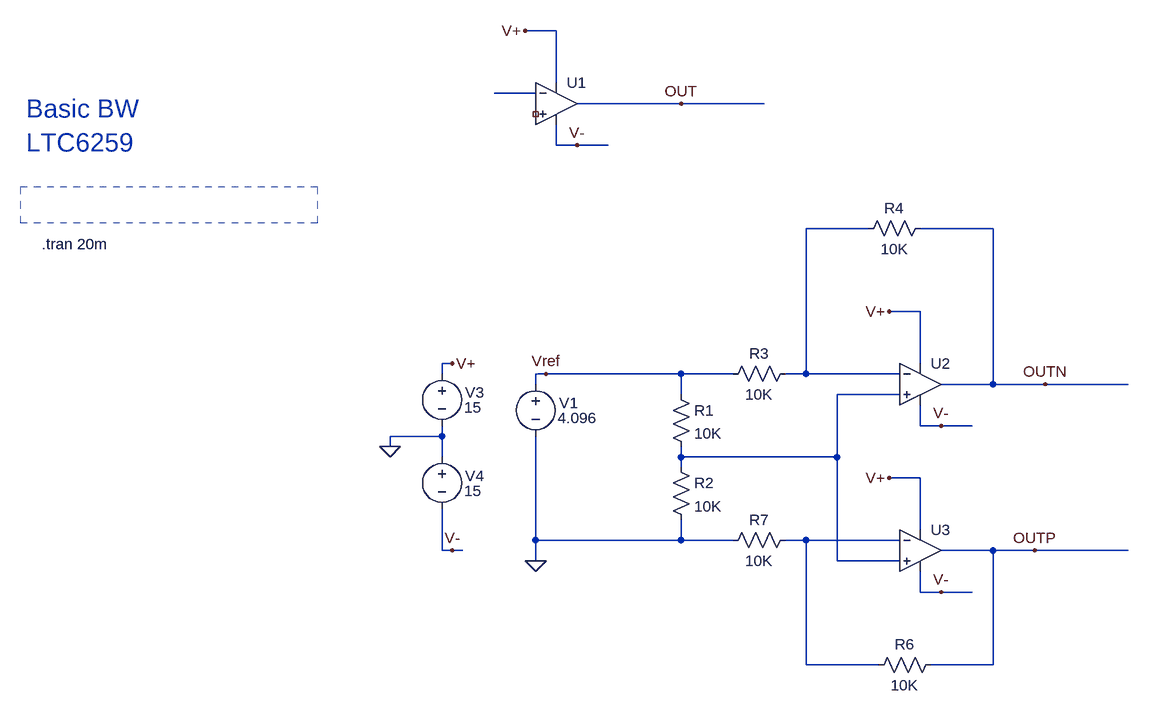
[diagram p0: schematic SEtoDiff.asc]
SEtoDiff.asc, the LTspice schematic file:
Version 4
SHEET 1 1928 1456
WIRE -4784 -3424 -4832 -3424
WIRE -4784 -3344 -4784 -3424
WIRE -4816 -3328 -4880 -3328
WIRE -4592 -3312 -4752 -3312
WIRE -4464 -3312 -4592 -3312
WIRE -4784 -3248 -4784 -3280
WIRE -4752 -3248 -4784 -3248
WIRE -4704 -3248 -4752 -3248
WIRE -4304 -3120 -4400 -3120
WIRE -4112 -3120 -4224 -3120
WIRE -4224 -2992 -4272 -2992
WIRE -4944 -2912 -4960 -2912
WIRE -4224 -2912 -4224 -2992
WIRE -4960 -2896 -4960 -2912
WIRE -4800 -2896 -4816 -2896
WIRE -4592 -2896 -4800 -2896
WIRE -4512 -2896 -4592 -2896
WIRE -4400 -2896 -4400 -3120
WIRE -4400 -2896 -4432 -2896
WIRE -4256 -2896 -4400 -2896
WIRE -4816 -2880 -4816 -2896
WIRE -4112 -2880 -4112 -3120
WIRE -4112 -2880 -4192 -2880
WIRE -4032 -2880 -4112 -2880
WIRE -3904 -2880 -4032 -2880
WIRE -4592 -2864 -4592 -2896
WIRE -4256 -2864 -4352 -2864
WIRE -4224 -2816 -4224 -2848
WIRE -4192 -2816 -4224 -2816
WIRE -4144 -2816 -4192 -2816
WIRE -4960 -2800 -4960 -2816
WIRE -4960 -2800 -5040 -2800
WIRE -5040 -2784 -5040 -2800
WIRE -4960 -2768 -4960 -2800
WIRE -4592 -2768 -4592 -2784
WIRE -4352 -2768 -4352 -2864
WIRE -4352 -2768 -4592 -2768
WIRE -4592 -2752 -4592 -2768
WIRE -4224 -2736 -4272 -2736
WIRE -4224 -2656 -4224 -2736
WIRE -4816 -2640 -4816 -2800
WIRE -4592 -2640 -4592 -2672
WIRE -4592 -2640 -4816 -2640
WIRE -4512 -2640 -4592 -2640
WIRE -4400 -2640 -4432 -2640
WIRE -4256 -2640 -4400 -2640
WIRE -4960 -2624 -4960 -2688
WIRE -4944 -2624 -4960 -2624
WIRE -4928 -2624 -4944 -2624
WIRE -4112 -2624 -4192 -2624
WIRE -4048 -2624 -4112 -2624
WIRE -3904 -2624 -4048 -2624
WIRE -4816 -2608 -4816 -2640
WIRE -4352 -2608 -4352 -2768
WIRE -4256 -2608 -4352 -2608
WIRE -4224 -2560 -4224 -2592
WIRE -4192 -2560 -4224 -2560
WIRE -4144 -2560 -4192 -2560
WIRE -4400 -2448 -4400 -2640
WIRE -4288 -2448 -4400 -2448
WIRE -4112 -2448 -4112 -2624
WIRE -4112 -2448 -4208 -2448
FLAG -4832 -3424 V+
FLAG -4944 -2912 V+
FLAG -5040 -2784 0
FLAG -4944 -2624 V-
FLAG -4752 -3248 V-
FLAG -4592 -3312 OUT
FLAG -4800 -2896 Vref
FLAG -4816 -2608 0
FLAG -4272 -2992 V+
FLAG -4192 -2816 V-
FLAG -4032 -2880 OUTN
FLAG -4272 -2736 V+
FLAG -4192 -2560 V-
FLAG -4048 -2624 OUTP
SYMBOL Opamps\\UniversalOpamp2 -4784 -3312 R0
SYMATTR Value2 Avol=1000000 GBW=1Meg Slew=0.22Meg
SYMATTR SpiceLine2 en=1.2n enk=10 in=3.75p ink=30 Rin=500Meg
SYMATTR InstName U1
SYMBOL voltage -4960 -2912 R0
WINDOW 0 36 45 Left 2
WINDOW 3 34 68 Left 2
WINDOW 123 0 0 Left 2
WINDOW 39 0 0 Left 2
SYMATTR InstName V3
SYMATTR Value 15
SYMBOL voltage -4960 -2784 R0
WINDOW 0 36 45 Left 2
WINDOW 3 34 68 Left 2
WINDOW 123 0 0 Left 2
WINDOW 39 0 0 Left 2
SYMATTR InstName V4
SYMATTR Value 15
SYMBOL voltage -4816 -2896 R0
WINDOW 0 36 45 Left 2
WINDOW 3 34 68 Left 2
WINDOW 123 0 0 Left 2
WINDOW 39 0 0 Left 2
SYMATTR InstName V1
SYMATTR Value 4.096
SYMBOL res -4608 -2880 R0
SYMATTR InstName R1
SYMATTR Value 10K
SYMBOL res -4608 -2768 R0
SYMATTR InstName R2
SYMATTR Value 10K
SYMBOL Opamps\\UniversalOpamp2 -4224 -2880 R0
SYMATTR Value2 Avol=1000000 GBW=1Meg Slew=0.22Meg
SYMATTR SpiceLine2 en=1.2n enk=10 in=3.75p ink=30 Rin=500Meg
SYMATTR InstName U2
SYMBOL res -4416 -2912 R90
WINDOW 0 0 56 VBottom 2
WINDOW 3 32 56 VTop 2
SYMATTR InstName R3
SYMATTR Value 10K
SYMBOL res -4208 -3136 R90
WINDOW 0 0 56 VBottom 2
WINDOW 3 32 56 VTop 2
SYMATTR InstName R4
SYMATTR Value 10K
SYMBOL Opamps\\UniversalOpamp2 -4224 -2624 R0
SYMATTR Value2 Avol=1000000 GBW=1Meg Slew=0.22Meg
SYMATTR SpiceLine2 en=1.2n enk=10 in=3.75p ink=30 Rin=500Meg
SYMATTR InstName U3
SYMBOL res -4192 -2464 R90
WINDOW 0 0 56 VBottom 2
WINDOW 3 32 56 VTop 2
SYMATTR InstName R6
SYMATTR Value 10K
SYMBOL res -4416 -2656 R90
WINDOW 0 0 56 VBottom 2
WINDOW 3 32 56 VTop 2
SYMATTR InstName R7
SYMATTR Value 10K
TEXT -5600 -3304 Left 4 ;Basic BW\nLTC6259
TEXT -5576 -3096 Left 2 !.tran 20m
RECTANGLE Normal -5152 -3128 -5608 -3184 2

The netlist it stands for:
* SEtoDiff.asc
XU1 NC_01 N001 V+ V- OUT level.2 Avol=1000000 GBW=1Meg Slew=0.22Meg ilimit=25m rail=0 Vos=0 phimargin=45 en=1.2n enk=10 in=3.75p ink=30 Rin=500Meg  ; pins IN+ IN- V+ V- OUT
V3 V+ 0 15
V4 0 V- 15
V1 Vref 0 4.096
R1 Vref N003 10K
R2 N003 0 10K
XU2 N003 N002 V+ V- OUTN level.2 Avol=1000000 GBW=1Meg Slew=0.22Meg ilimit=25m rail=0 Vos=0 phimargin=45 en=1.2n enk=10 in=3.75p ink=30 Rin=500Meg  ; pins IN+ IN- V+ V- OUT
R3 N002 Vref 10K
R4 OUTN N002 10K
XU3 N003 N004 V+ V- OUTP level.2 Avol=1000000 GBW=1Meg Slew=0.22Meg ilimit=25m rail=0 Vos=0 phimargin=45 en=1.2n enk=10 in=3.75p ink=30 Rin=500Meg  ; pins IN+ IN- V+ V- OUT
R6 OUTP N004 10K
R7 N004 0 10K
* Basic BW
* LTC6259
.tran 20m
.lib UniversalOpamps2.sub
.backanno
.end